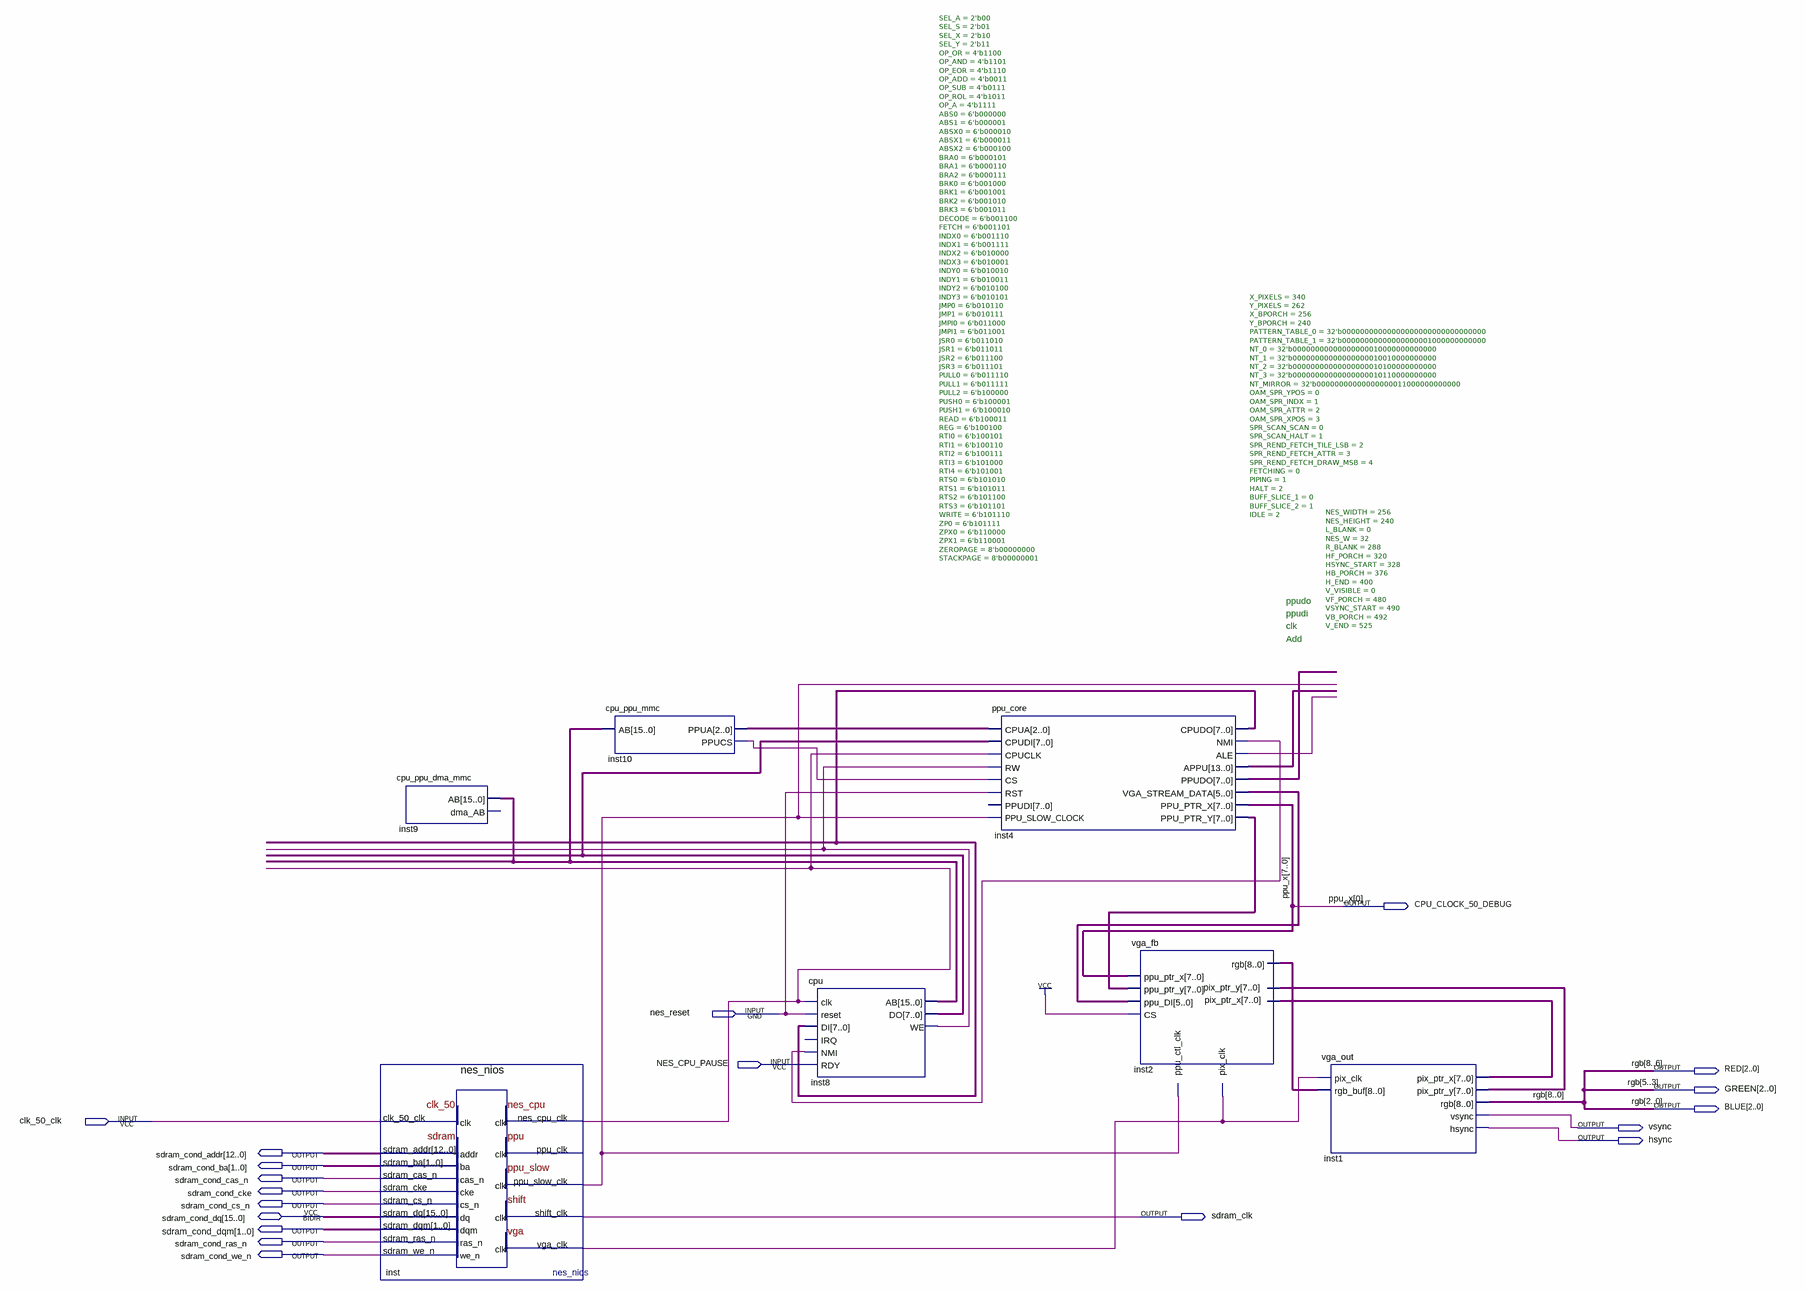
[diagram p0: schematic sheet]
// Quartus schematic nes_clean_top.bdf as structural Verilog: 7 symbols, 19 pins
module nes_clean_top (
  input  nes_reset,
  input  NES_CPU_PAUSE,
  input  clk_50_clk,
  inout  [15:0] sdram_cond_dq,
  output CPU_CLOCK_50_DEBUG,
  output [2:0] RED,
  output [2:0] GREEN,
  output [2:0] BLUE,
  output vsync,
  output hsync,
  output [12:0] sdram_cond_addr,
  output [1:0] sdram_cond_ba,
  output sdram_cond_cas_n,
  output sdram_cond_cke,
  output sdram_cond_cs_n,
  output sdram_clk,
  output [1:0] sdram_cond_dqm,
  output sdram_cond_ras_n,
  output sdram_cond_we_n
);

  wire inst4_ale, inst4_nmi, inst8_we, inst10_ppucs, inst_nes_cpu_clk, inst_ppu_slow_clk, inst_vga_clk;
  wire [2:0] inst10_ppua;
  wire [5:0] inst4_vga_stream_data;
  wire [7:0] inst1_pix_ptr_x, inst1_pix_ptr_y, inst4_cpudo, inst4_ppu_ptr_y, inst4_ppudo, inst8_do;
  wire [7:1] ppu_x;
  wire [8:0] inst2_rgb;
  wire [13:0] inst4_appu;
  wire [15:0] inst9_ab;

  cpu_ppu_dma_mmc inst9 (.AB(inst9_ab));  // open: dma_AB
  nes_nios inst (
    .clk_50_clk(clk_50_clk), .nes_cpu_clk(inst_nes_cpu_clk), .ppu_slow_clk(inst_ppu_slow_clk),
    .sdram_addr(sdram_cond_addr), .sdram_ba(sdram_cond_ba), .sdram_cas_n(sdram_cond_cas_n),
    .sdram_cke(sdram_cond_cke), .sdram_cs_n(sdram_cond_cs_n), .sdram_dqm(sdram_cond_dqm),
    .sdram_ras_n(sdram_cond_ras_n), .sdram_we_n(sdram_cond_we_n), .shift_clk(sdram_clk),
    .vga_clk(inst_vga_clk), .sdram_dq(sdram_cond_dq));  // open: ppu_clk
  cpu_ppu_mmc inst10 (.AB(inst9_ab), .PPUA(inst10_ppua), .PPUCS(inst10_ppucs));
  cpu #(.SEL_A(2'b00), .SEL_S(2'b01), .SEL_X(2'b10), .SEL_Y(2'b11), .OP_OR(4'b1100), .OP_AND(4'b1101), .OP_EOR(4'b1110), .OP_ADD(4'b0011), .OP_SUB(4'b0111), .OP_ROL(4'b1011), .OP_A(4'b1111), .ABS0(6'b000000), .ABS1(6'b000001), .ABSX0(6'b000010), .ABSX1(6'b000011), .ABSX2(6'b000100), .BRA0(6'b000101), .BRA1(6'b000110), .BRA2(6'b000111), .BRK0(6'b001000), .BRK1(6'b001001), .BRK2(6'b001010), .BRK3(6'b001011), .DECODE(6'b001100), .FETCH(6'b001101), .INDX0(6'b001110), .INDX1(6'b001111), .INDX2(6'b010000), .INDX3(6'b010001), .INDY0(6'b010010), .INDY1(6'b010011), .INDY2(6'b010100), .INDY3(6'b010101), .JMP0(6'b010110), .JMP1(6'b010111), .JMPI0(6'b011000), .JMPI1(6'b011001), .JSR0(6'b011010), .JSR1(6'b011011), .JSR2(6'b011100), .JSR3(6'b011101), .PULL0(6'b011110), .PULL1(6'b011111), .PULL2(6'b100000), .PUSH0(6'b100001), .PUSH1(6'b100010), .READ(6'b100011), .REG(6'b100100), .RTI0(6'b100101), .RTI1(6'b100110), .RTI2(6'b100111), .RTI3(6'b101000), .RTI4(6'b101001), .RTS0(6'b101010), .RTS1(6'b101011), .RTS2(6'b101100), .RTS3(6'b101101), .WRITE(6'b101110), .ZP0(6'b101111), .ZPX0(6'b110000), .ZPX1(6'b110001), .ZEROPAGE(8'b00000000), .STACKPAGE(8'b00000001)) inst8 (
    .clk(inst_nes_cpu_clk), .reset(nes_reset), .DI(inst4_cpudo), .NMI(inst4_nmi), .RDY(NES_CPU_PAUSE),
    .AB(inst9_ab), .DO(inst8_do), .WE(inst8_we));  // open: IRQ
  ppu_core #(.X_PIXELS(340), .Y_PIXELS(262), .X_BPORCH(256), .Y_BPORCH(240), .PATTERN_TABLE_0(32'b00000000000000000000000000000000), .PATTERN_TABLE_1(32'b00000000000000000001000000000000), .NT_0(32'b00000000000000000010000000000000), .NT_1(32'b00000000000000000010010000000000), .NT_2(32'b00000000000000000010100000000000), .NT_3(32'b00000000000000000010110000000000), .NT_MIRROR(32'b00000000000000000011000000000000), .OAM_SPR_YPOS(0), .OAM_SPR_INDX(1), .OAM_SPR_ATTR(2), .OAM_SPR_XPOS(3), .SPR_SCAN_SCAN(0), .SPR_SCAN_HALT(1), .SPR_REND_FETCH_TILE_LSB(2), .SPR_REND_FETCH_ATTR(3), .SPR_REND_FETCH_DRAW_MSB(4), .FETCHING(0), .PIPING(1), .HALT(2), .BUFF_SLICE_1(0), .BUFF_SLICE_2(1), .IDLE(2)) inst4 (
    .CPUA(inst10_ppua), .CPUDI(inst8_do), .CPUCLK(inst_nes_cpu_clk), .RW(inst8_we), .CS(inst10_ppucs),
    .RST(nes_reset), .PPU_SLOW_CLOCK(inst_ppu_slow_clk), .CPUDO(inst4_cpudo), .NMI(inst4_nmi),
    .ALE(inst4_ale), .APPU(inst4_appu), .PPUDO(inst4_ppudo), .VGA_STREAM_DATA(inst4_vga_stream_data),
    .PPU_PTR_X({ppu_x, CPU_CLOCK_50_DEBUG}), .PPU_PTR_Y(inst4_ppu_ptr_y));  // open: PPUDI
  vga_fb inst2 (
    .ppu_ctl_clk(inst_ppu_slow_clk), .ppu_ptr_x({ppu_x, CPU_CLOCK_50_DEBUG}), .ppu_ptr_y(inst4_ppu_ptr_y),
    .ppu_DI(inst4_vga_stream_data), .CS(1'b1), .pix_clk(inst_vga_clk), .pix_ptr_x(inst1_pix_ptr_x),
    .pix_ptr_y(inst1_pix_ptr_y), .rgb(inst2_rgb));
  vga_out #(.NES_WIDTH(256), .NES_HEIGHT(240), .L_BLANK(0), .NES_W(32), .R_BLANK(288), .HF_PORCH(320), .HSYNC_START(328), .HB_PORCH(376), .H_END(400), .V_VISIBLE(0), .VF_PORCH(480), .VSYNC_START(490), .VB_PORCH(492), .V_END(525)) inst1 (
    .pix_clk(inst_vga_clk), .rgb_buf(inst2_rgb), .pix_ptr_x(inst1_pix_ptr_x), .pix_ptr_y(inst1_pix_ptr_y),
    .rgb({RED, GREEN, BLUE}), .vsync(vsync), .hsync(hsync));

  // Other names for the same wires on the sheet: ppu_x[0] = CPU_CLOCK_50_DEBUG; rgb[8:0] = {RED, GREEN, BLUE}

  // Notes on the sheet:
  //   ppudo
  //   ppudi
  //   clk
  //   Add
endmodule
